# EAGLE schematic Simon (EAGLE 7.7.0)
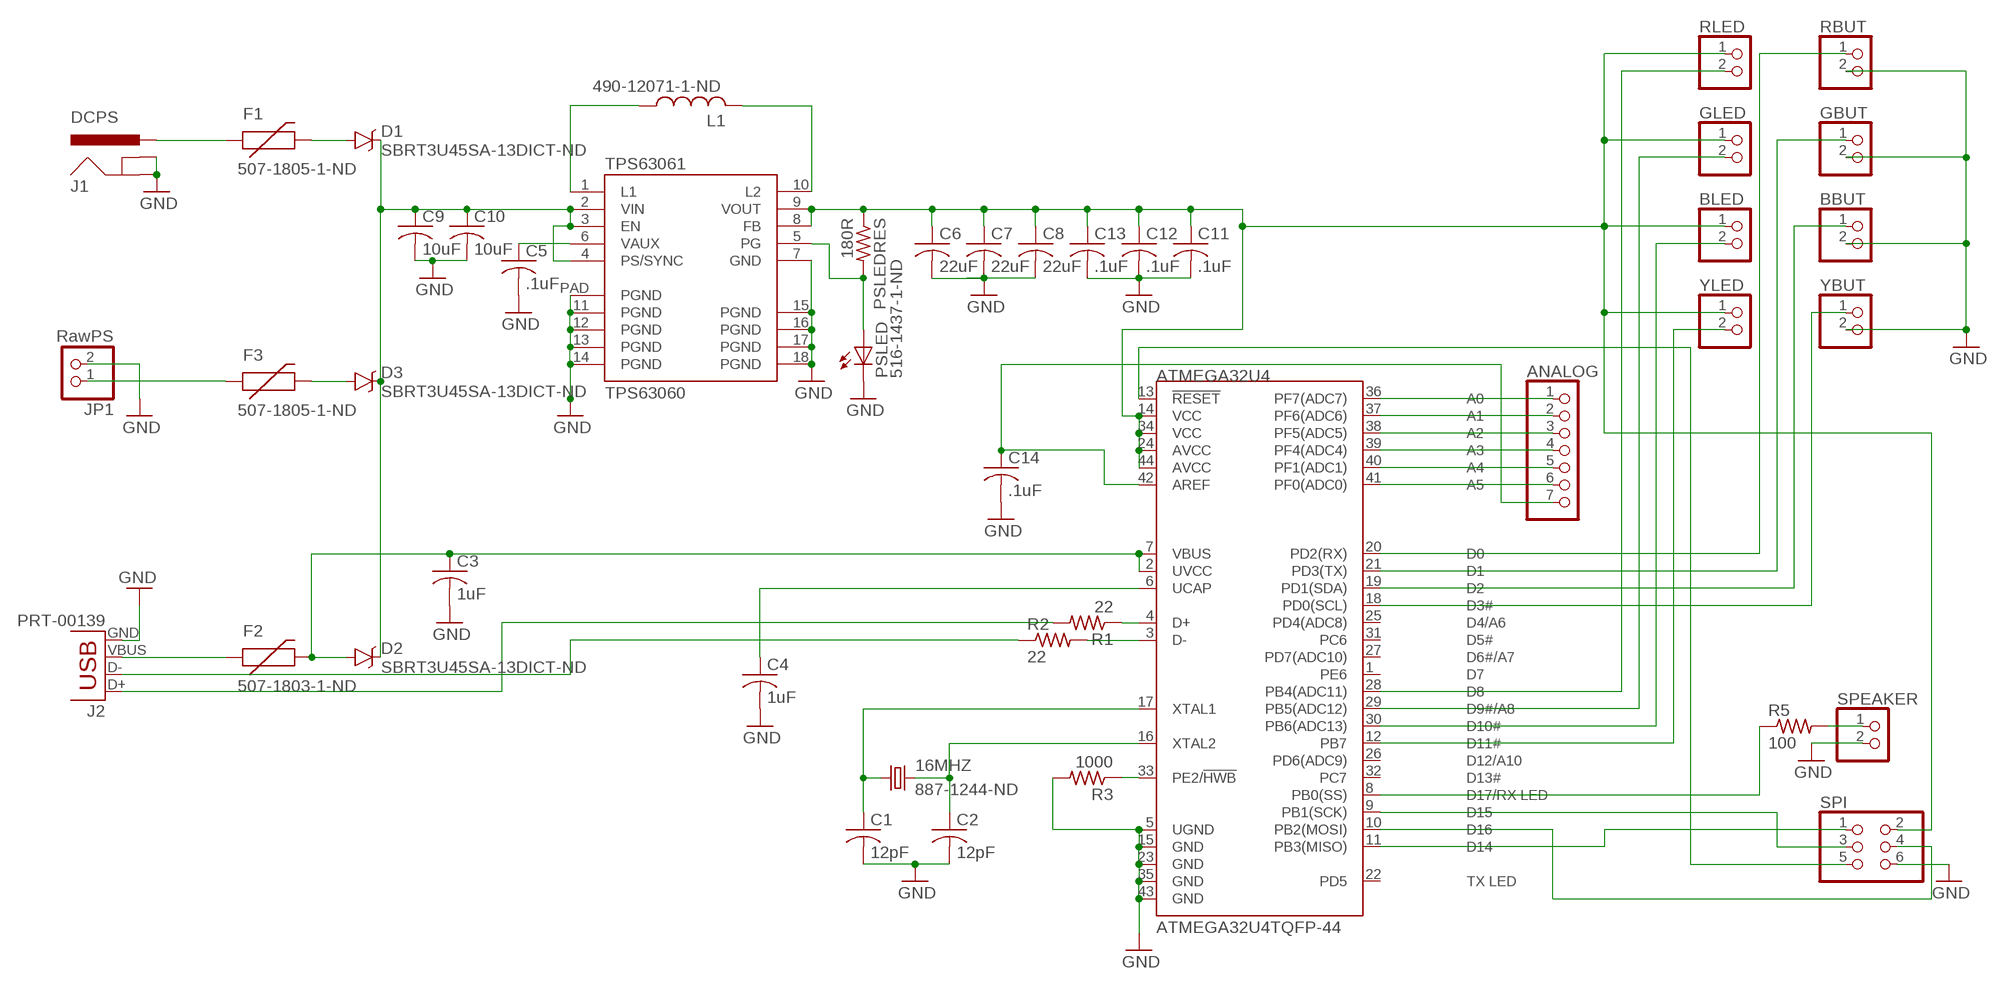
[diagram p0: schematic, sheet 1]

## Parts
16MHZ  887-1244-ND  CRYSTALHC49US  [HC49US]
ANALOG  PINHD-1X7  [1X07]
ATMEGA32U4  ATMEGA32U4TQFP-44  [TQFP44]
BBUT  PINHD-1X2  [1X02]
BLED  PINHD-1X2  [1X02]
C1  12pF  C-USC0805  [C0805]
C2  12pF  C-USC0805  [C0805]
C3  1uF  C-USC0805  [C0805]
C4  1uF  C-USC0805  [C0805]
C5  .1uF  C-USC0805  [C0805]
C6  22uF  C-USC0805  [C0805]
C7  22uF  C-USC0805  [C0805]
C8  22uF  C-USC0805  [C0805]
C9  10uF  C-USC0805  [C0805]
C10  10uF  C-USC0805  [C0805]
C11  .1uF  C-USC0805  [C0805]
C12  .1uF  C-USC0805  [C0805]
C13  .1uF  C-USC0805  [C0805]
C14  .1uF  C-USC0805  [C0805]
D1  SBRT3U45SA-13DICT-ND  MBRA140  [SMA-DIODE]
D2  SBRT3U45SA-13DICT-ND  MBRA140  [SMA-DIODE]
D3  SBRT3U45SA-13DICT-ND  MBRA140  [SMA-DIODE]
F1  507-1805-1-ND  PTCSMD-W  [PTC-1206-WIDE]
F2  507-1803-1-ND  PTCSMD-W  [PTC-1206-WIDE]
F3  507-1805-1-ND  PTCSMD-W  [PTC-1206-WIDE]
GBUT  PINHD-1X2  [1X02]
GLED  PINHD-1X2  [1X02]
J1  DCPS  POWER_JACKSMD  [POWER_JACK_SMD]
J2  PRT-00139  USBPTH  [USB-B-PTH]
JP1  RawPS  PINHD-1X2/90  [1X02/90]
L1  490-12071-1-ND  L-USL2012C  [L2012C]
PSLED  516-1437-1-ND  LEDSML0805  [SML0805]
PSLEDRES  180R  R-US_R0805  [R0805]
R1  22  R-US_R0805  [R0805]
R2  22  R-US_R0805  [R0805]
R3  1000  R-US_R0805  [R0805]
R5  100  R-US_R0805  [R0805]
RBUT  PINHD-1X2  [1X02]
RLED  PINHD-1X2  [1X02]
SPEAKER  PINHD-1X2  [1X02]
SPI  PINHD-2X3  [2X03]
TPS63061  TPS63060  [QFN-10_PAD-8]
YBUT  PINHD-1X2  [1X02]
YLED  PINHD-1X2  [1X02]

## Nets
5VREG: ATMEGA32U4.14(VCC) ATMEGA32U4.24(AVCC) ATMEGA32U4.34(VCC) ATMEGA32U4.44(AVCC) BLED.1 C6.1 C7.1 C8.1 C11.1 C12.1 C13.1 GLED.1 PSLEDRES.1 RLED.1 SPI.2 TPS63061.8(FB) TPS63061.9(VOUT) YLED.1
A0SIG: ANALOG.1 ATMEGA32U4.36(PF7(ADC7))
A1SIG: ANALOG.2 ATMEGA32U4.37(PF6(ADC6))
A2SIG: ANALOG.3 ATMEGA32U4.38(PF5(ADC5))
A3SIG: ANALOG.4 ATMEGA32U4.39(PF4(ADC4))
A4SIG: ANALOG.5 ATMEGA32U4.40(PF1(ADC1))
A5SIG: ANALOG.6 ATMEGA32U4.41(PF0(ADC0))
AREF: ANALOG.7 ATMEGA32U4.42(AREF) C14.1
BBUTSIG: ATMEGA32U4.19(PD1(SDA)) BBUT.1
BLEDSIG: ATMEGA32U4.30(PB6(ADC13)) BLED.2
D_N: ATMEGA32U4.3(D-) R2.2
D_P: ATMEGA32U4.4(D+) R1.1
FUSED-DCIN: D1.A F1.2
FUSED-RAWPS: D3.A F3.2
FUSED-USBIN: ATMEGA32U4.2(UVCC) ATMEGA32U4.7(VBUS) C3.1 D2.A F2.2
GBUTSIG: ATMEGA32U4.21(PD3(TX)) GBUT.1
GLEDSIG: ATMEGA32U4.29(PB5(ADC12)) GLED.2
GND: ATMEGA32U4.5(UGND) ATMEGA32U4.15(GND) ATMEGA32U4.23(GND) ATMEGA32U4.35(GND) ATMEGA32U4.43(GND) BBUT.2 C1.2 C2.2 C3.2 C4.2 C5.2 C6.2 C7.2 C8.2 C9.2 C10.2 C11.2 C12.2 C13.2 C14.2 GBUT.2 J1.GND(GNDBREAK) J1.P$4(GND) J2.GND JP1.2 PSLED.C R3.2 RBUT.2 SPEAKER.2 SPI.6 TPS63061.7(GND) TPS63061.11(PGND) TPS63061.12(PGND) TPS63061.13(PGND) TPS63061.14(PGND) TPS63061.15(PGND) TPS63061.16(PGND) TPS63061.17(PGND) TPS63061.18(PGND) TPS63061.PAD(PGND) YBUT.2
HWB: ATMEGA32U4.33(PE2/!HWB) R3.1
IND1: L1.1 TPS63061.1(L1)
IND2: L1.2 TPS63061.10(L2)
MISO: ATMEGA32U4.11(PB3(MISO)) SPI.1
MOSI: ATMEGA32U4.10(PB2(MOSI)) SPI.4
PGSIGNAL: PSLED.A PSLEDRES.2 TPS63061.5(PG)
PSCAP: C5.1 TPS63061.6(VAUX)
PSIN: C9.1 C10.1 D1.C D2.C D3.C TPS63061.2(VIN) TPS63061.3(EN) TPS63061.4(PS/SYNC)
RAW-DC: F1.1 J1.VIN0(PWR)
RAW-PS: F3.1 JP1.1
RAW-USB_N: J2.D- R2.1
RAW-USB_P: J2.D+ R1.2
RAW-VUSB: F2.1 J2.VBUS
RBUTSIG: ATMEGA32U4.20(PD2(RX)) RBUT.1
RESET: ATMEGA32U4.13(!RESET) SPI.5
RLEDSIG: ATMEGA32U4.28(PB4(ADC11)) RLED.2
SPEAKERPORT: ATMEGA32U4.8(PB0(SS)) R5.1
SPEAKERSUPPLY: R5.2 SPEAKER.1
SPICLOCK: ATMEGA32U4.9(PB1(SCK)) SPI.3
UCAP: ATMEGA32U4.6(UCAP) C4.1
XTAL1: 16MHZ.1 ATMEGA32U4.17(XTAL1) C1.1
XTAL2: 16MHZ.2 ATMEGA32U4.16(XTAL2) C2.1
YBUTSIG: ATMEGA32U4.18(PD0(SCL)) YBUT.1
YLEDSIG: ATMEGA32U4.12(PB7) YLED.2
Unconnected: ATMEGA32U4.1(PE6) ATMEGA32U4.22(PD5) ATMEGA32U4.25(PD4(ADC8)) ATMEGA32U4.26(PD6(ADC9)) ATMEGA32U4.27(PD7(ADC10)) ATMEGA32U4.31(PC6) ATMEGA32U4.32(PC7)

## Library data of the parts
16MHZ = SparkFun-FreqCtrl:CRYSTAL: Various standard crystals. Proven footprints.
ANALOG = pinhead:PINHD-1X7: PIN HEADER
ATMEGA32U4 = SparkFun-DigitalIC:ATMEGA32U4: Atmel 44-pin 8-bit Microcontroller with 32KBytes of ISP Flash and USB Controller
BBUT BLED GBUT GLED JP1 RBUT RLED SPEAKER YBUT YLED = pinhead:PINHD-1X2: PIN HEADER
C1-C5 C11-C14 = rcl:C-US: CAPACITOR, American symbol
C6-C10 = resistor:C-US: CAPACITOR, American symbol
D1-D3 = SparkFun-DiscreteSemi:MBRA140: 40V, 1A Schottky rectifier SMA/DO-214AC package DIO-08053; PROD_ID: DIO-08053
F1-F3 = SparkFun-PowerIC:PTC: Resettable Fuse PTC Resettable Fuse. Spark Fun Electronics SKU : COM-08357
J1 = SparkFun-Connectors:POWER_JACK: Power Jack This is the standard 5.5mm barrel jack for power. The PTH is the most common, proven, reliable, footprint. The Slot footprint only works if the mill layer is transmitted to the PCB fab house so be warned. Mating wall wart : TOL-00298 (and others); PROD_ID: CONN-08106; SF_ID: PRT-12748; VALUE: 5.5x2.1mm Barrel
J2 = SparkFun-Connectors:USB: USB Connectors USB-B-PTH is fully proven SKU : PRT-00139/CONN-08278 USB-miniB is fully proven SKU : PRT-00587 USB-A-PCB is untested. USB-A-H is throughly reviewed, but untested. Spark Fun Electronics SKU : PRT-00437 USB-B-SMT is throughly reviewed, but untested. Needs silkscreen touching up. USB-A-S has not been used/tested USB-MB-H has not been used/tested USB-MICROB has been used. CONN-09505; PROD_ID: CONN-08278; VALUE: USB-B
L1 = rcl:L-US: INDUCTOR, American symbol
PSLED = led:LED: LED OSRAM: - CHIPLED LG R971, LG N971, LY N971, LG Q971, LY Q971, LO R971, LY R971 LH N974, LH R974 LS Q976, LO Q976, LY Q976 LO Q996 - Hyper CHIPLED LW Q18S LB Q993, LB Q99A, LB R99A - SideLED LS A670, LO A670, LY A670, LG A670, LP A670 LB A673, LV A673, LT A673, LW A673 LH A674 LY A675 LS A676, LA A676, LO A676, LY A676, LW A676 LS A679, LY A679, LG A679 - Hyper Micro SIDELED® LS Y876, LA Y876, LO Y876, LY Y876 LT Y87S - SmartLED LW L88C, LW L88S LB L89C, LB L89S, LG L890 LS L89K, LO L89K, LY L89K LS L896, LA L896, LO L896, LY L896 - TOPLED LS T670, LO T670, LY T670, LG T670, LP T670 LSG T670, LSP T670, LSY T670, LOP T670, LYG T670 LG T671, LOG T671, LSG T671 LB T673, LV T673, LT T673, LW T673 LH T674 LS T676, LA T676, LO T676, LY T676, LB T676, LH T676, LSB T676, LW T676 LB T67C, LV T67C, LT T67C, LS T67K, LO T67K, LY T67K, LW E67C LS E67B, LA E67B, LO E67B, LY E67B, LB E67C, LV E67C, LT E67C LW T67C LS T679, LY T679, LG T679 LS T770, LO T770, LY T770, LG T770, LP T770 LB T773, LV T773, LT T773, LW T773 LH T774 LS E675, LA E675, LY E675, LS T675 LS T776, LA T776, LO T776, LY T776, LB T776 LHGB T686 LT T68C, LB T68C - Hyper Mini TOPLED® LB M676 - Mini TOPLED Santana® LG M470 LS M47K, LO M47K, LY M47K Source: http://www.osram.convergy.de LUXEON: - LUMILED® LXK2-PW12-R00, LXK2-PW12-S00, LXK2-PW14-U00, LXK2-PW14-V00 LXK2-PM12-R00, LXK2-PM12-S00, LXK2-PM14-U00 LXK2-PE12-Q00, LXK2-PE12-R00, LXK2-PE12-S00, LXK2-PE14-T00, LXK2-PE14-U00 LXK2-PB12-K00, LXK2-PB12-L00, LXK2-PB12-M00, LXK2-PB14-N00, LXK2-PB14-P00, LXK2-PB14-Q00 LXK2-PR12-L00, LXK2-PR12-M00, LXK2-PR14-Q00, LXK2-PR14-R00 LXK2-PD12-Q00, LXK2-PD12-R00, LXK2-PD12-S00 LXK2-PH12-R00, LXK2-PH12-S00 LXK2-PL12-P00, LXK2-PL12-Q00, LXK2-PL12-R00 Source: www.luxeon.com KINGBRIGHT: KA-3528ASYC Source: www.kingbright.com
PSLEDRES R1-R3 R5 = resistor:R-US_: RESISTOR, American symbol
SPI = pinhead:PINHD-2X3: PIN HEADER
TPS63061 = SparkFun-PowerIC:TPS63060: Texas Instruments TPS63060 High Input Buck-Boost Converter. Available in adjustable and fixed output voltage versions. Is packaged in a 10-pin PWSON package measuring about 3 x 3 mm. Datasheet <http://www.ti.com/lit/ds/symlink/tps63060.pdf>